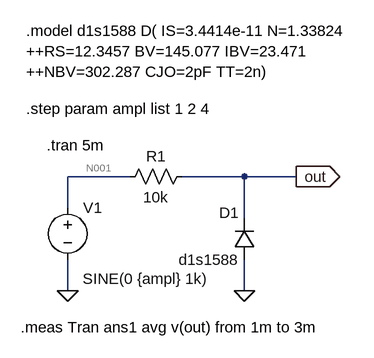
[diagram p0: schematic fig19sine.asc]
fig19sine.asc, the LTspice schematic file:
Version 4
SHEET 1 880 680
WIRE 192 96 96 96
WIRE 368 96 272 96
WIRE 448 96 368 96
WIRE 96 144 96 96
WIRE 368 160 368 96
WIRE 96 272 96 224
WIRE 368 272 368 224
FLAG 96 272 0
FLAG 368 272 0
FLAG 448 96 out
IOPIN 448 96 Out
SYMBOL voltage 96 128 R0
WINDOW 3 23 125 Left 0
WINDOW 123 0 0 Left 0
WINDOW 39 0 0 Left 0
SYMATTR Value SINE(0 {ampl} 1k)
SYMATTR InstName V1
SYMBOL res 176 112 R270
WINDOW 0 32 56 VTop 0
WINDOW 3 0 56 VBottom 0
SYMATTR InstName R1
SYMATTR Value 10k
SYMBOL diode 384 224 R180
WINDOW 0 24 72 Left 0
WINDOW 3 24 0 Left 0
SYMATTR InstName D1
SYMATTR Value d1s1588
TEXT 64 48 Left 0 !.tran 5m
TEXT 32 -8 Left 0 !.step param ampl list 1 2 4
TEXT 24 328 Left 0 !.meas Tran ans1 avg v(out) from 1m to 3m
TEXT 32 -128 Left 0 !.model d1s1588 D( IS=3.4414e-11 N=1.33824 \n++RS=12.3457 BV=145.077 IBV=23.471 \n++NBV=302.287 CJO=2pF TT=2n)

The netlist it stands for:
* fig19sine.asc
V1 N001 0 SINE(0 {ampl} 1k)
R1 N001 out 10k
D1 0 out d1s1588
.model D D
.lib standard.dio
.tran 5m
.step param ampl list 1 2 4
.meas Tran ans1 avg v(out) from 1m to 3m
.model d1s1588 D( IS=3.4414e-11 N=1.33824
++RS=12.3457 BV=145.077 IBV=23.471
++NBV=302.287 CJO=2pF TT=2n)
.backanno
.end

* Results of the author's LTspice run, read from the files saved beside the schematic
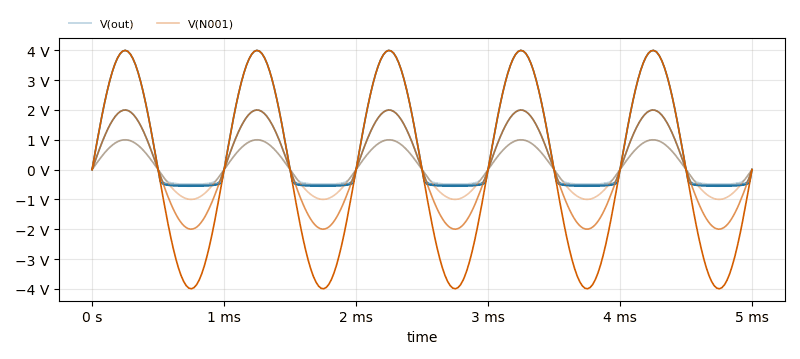
[diagram p1: Transient Analysis of fig19sine.asc, plotted from the saved traces]
* Transient Analysis, 5 runs:
*   V(out) [run 1]: min -491.7 mV, max 999.7 mV, average 118.8 mV, rms 581.5 mV, last -125.1 µV
*   V(out) [run 2]: 0 V at time=0 s, 0 V at time=0 s, min 0 V, max 0 V
*   V(out) [run 3]: min -528.5 mV, max 1.999 V, average 403.5 mV, rms 1.055 V, last -247.8 µV
*   V(out) [run 4]: 0 V at time=0 s, 0 V at time=0 s, min 0 V, max 0 V
*   V(out) [run 5]: min -557.9 mV, max 3.999 V, average 1.016 V, rms 2.033 V, last -427.1 µV
*   V(N001) [run 1]: min -999.8 mV, max 999.7 mV, average -193.7 µV, rms 706.9 mV, last 0 V
*   V(N001) [run 2]: 0 V at time=0 s, 0 V at time=0 s, min 0 V, max 0 V
*   V(N001) [run 3]: min -1.999 V, max 1.999 V, average -293.8 µV, rms 1.414 V, last 0 V
*   V(N001) [run 4]: 0 V at time=0 s, 0 V at time=0 s, min 0 V, max 0 V
*   V(N001) [run 5]: min -3.999 V, max 3.999 V, average -65.94 µV, rms 2.827 V, last 0 V
* From the log:
*   Measurement: ans1
*     step  AVG(v(out))  FROM  TO
*        1  0.11879  0.001  0.003
*        2  0.403533  0.001  0.003
*        3  1.01592  0.001  0.003